# EAGLE design diagram (EAGLE 9.6.2)
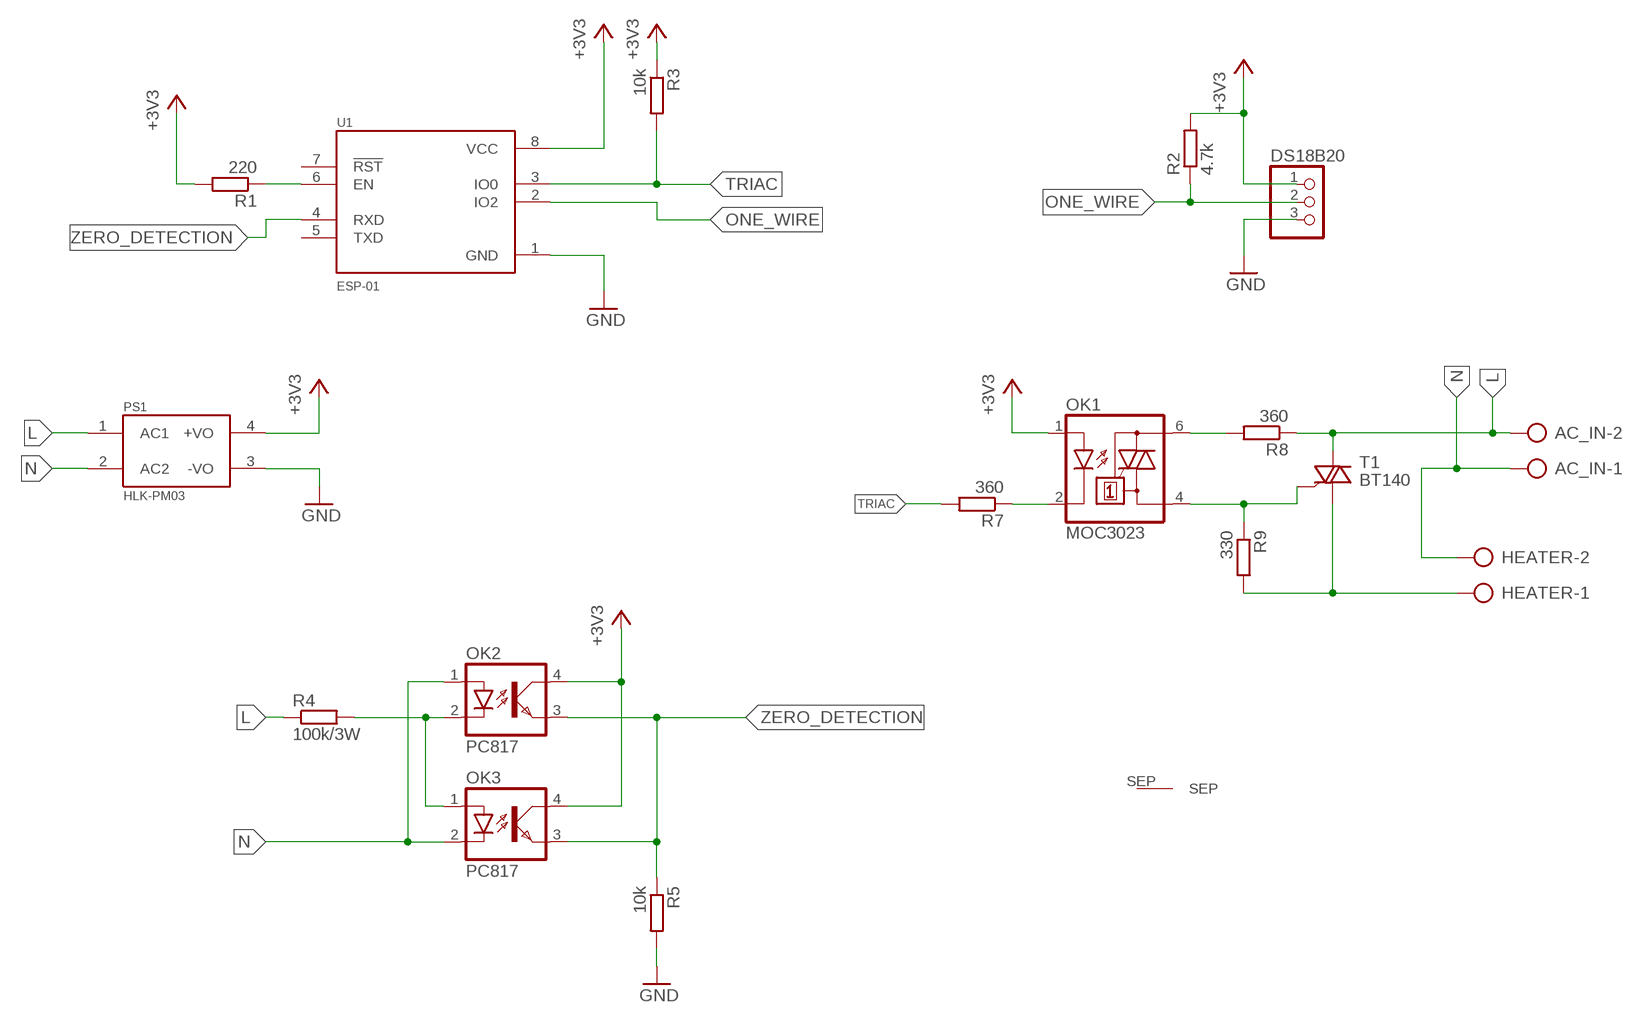
[diagram p0: schematic, sheet 1]

## Parts
AC_IN  AK300/2  [AK300/2]
DS18B20  PINHD-1X3  [1X03]
HEATER  AK300/2  [AK300/2]
OK1  MOC3023  MOC3041M  [DIL06]
OK2  PC817  [DIL04]
OK3  PC817  [DIL04]
PS1  HLK-PM03  [CONV_HLK-PM03]
R1  220  R-EU_R1206  [R1206]
R2  4.7k  R-EU_R1206  [R1206]
R3  10k  R-EU_0204/5  [0204/5]
R4  100k/3W  R-EU_0414/15  [0414/15]
R5  10k  R-EU_0204/7  [0204/7]
R7  360  R-EU_M1206  [M1206]
R8  360  R-EU_M1206  [M1206]
R9  330  R-EU_M1206  [M1206]
T1  BT140  BT138-V  [TO220BV]
U1  ESP-01  ESP8266-01/ESP-01  [XCVR_ESP8266-01/ESP-01]
U$1  TEST  [V7142]

## Nets
+3V3: DS18B20.1 OK1.1(A) OK2.4(COL) OK3.4(COL) PS1.4(+VO) R1.2 R2.2 R3.1 U1.8(VCC)
GND: DS18B20.3 PS1.3(-VO) R5.2 U1.1(GND)
L: AC_IN.2 PS1.1(AC1) R4.1 R8.1 T1.T2(A2)
N: AC_IN.1 HEATER.2 OK2.1(A) OK3.2(C) PS1.2(AC2)
N$1: R1.1 U1.6(EN)
N$4: OK2.2(C) OK3.1(A) R4.2
N$7: OK1.6(A2) R8.2
N$9: OK1.4(A1) R9.1 T1.G
N$11: HEATER.1 R9.2 T1.T1(A1)
N$39: OK1.2(C) R7.1
ONE_WIRE: DS18B20.2 R2.1 U1.2(IO2)
TRIAC: R3.2 R7.2 U1.3(IO0)
ZERO_DETECTION: OK2.3(EMIT) OK3.3(EMIT) R5.1 U1.4(RXD)
Unconnected: U1.5(TXD) U1.7(!RST) U$1.SEP

## Library data of the parts
AC_IN HEATER = con-ptr500:AK300/2: CONNECTOR; OC_FARNELL: unknown; OC_NEWARK: unknown
DS18B20 = pinhead:PINHD-1X3: PIN HEADER
OK1 = optocoupler:MOC30*: 6-Pin DIP Zero-Cross Optoisolators Triac Driver Output (250/400 Volt Peak) Source: Data sheet <http://www.fairchildsemi.com/ds/MO/MOC3031M.pdf> The old path of data sheet not more available 2013-05-06.; MF: FAIRCHILD SEMICONDUCTOR; MPN: MOC3041M; OC_FARNELL: 1086677; OC_NEWARK: 78K6090
OK2 OK3 = optocoupler:PC817: SHARP OPTO COUPLER; MPN: PC817X4J000F; OC_FARNELL: 9707727; OC_NEWARK: 97K7059
PS1 = HLK-PM03:HLK-PM03: Check availability <https://pricing.snapeda.com/parts/HLK-PM03/Hi-link/view-part?ref=eda>; AVAILABILITY: Not in stock; MF: Hi-link; MP: HLK-PM03; PACKAGE: Package; PRICE: None
R1-R5 R7-R9 = rcl:R-EU_: RESISTOR, European symbol; SPICEPREFIX: R
T1 = triac:BT138: TRIAC Source: http://www.semiconductors.philips.com BT138_SERIES_2.pdf
U1 = ESP8266-01_ESP-01:ESP8266-01/ESP-01: MakerFocus 4pcs ESP8266 ESP-01 Serial Wireless WiFi Transceiver Receiver Module 1MB SPI Flash DC3.0-3.6V Internet of Things WiFi Module Board Compatible with Ar duino Check availability <https://pricing.snapeda.com/parts/ESP8266-01/ESP-01/AI-Thinker/view-part?ref=eda>; AVAILABILITY: Not in stock; DESCRIPTION: MakerFocus 4pcs ESP8266 ESP-01 Serial Wireless WiFi Transceiver Receiver Module 1MB SPI Flash DC3.0-3.6V Internet of Things WiFi Module Board Compatible with Ar duino; MF: AI-Thinker; MP: ESP8266-01/ESP-01; PACKAGE: Non-Standard AI-Thinker; PRICE: None
U$1 = V7142_4:TEST: as

## Board
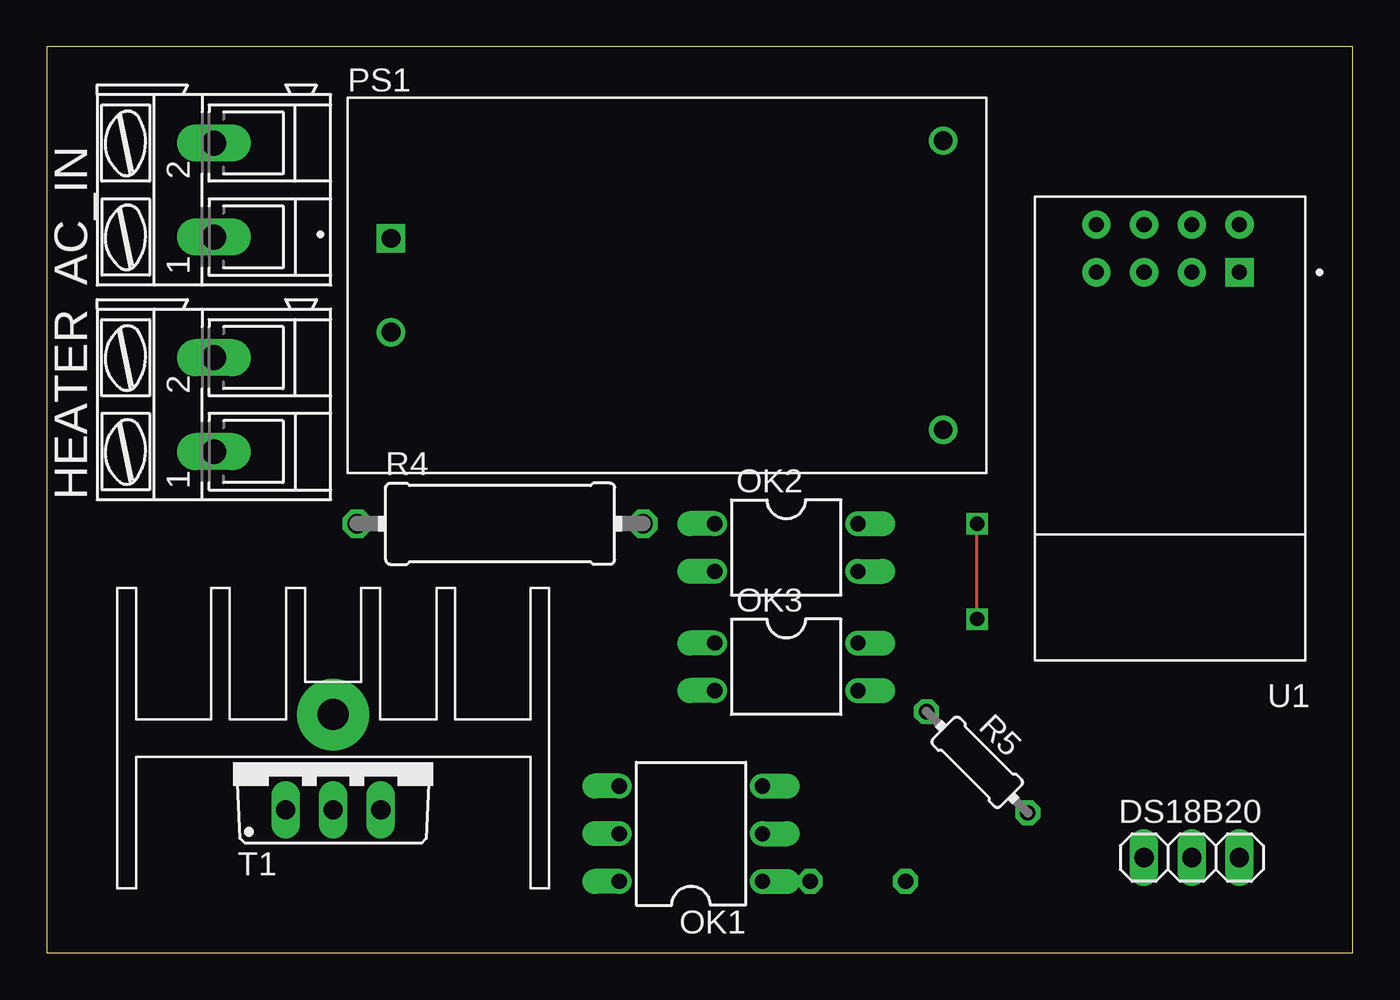
[diagram p1: board, top side]
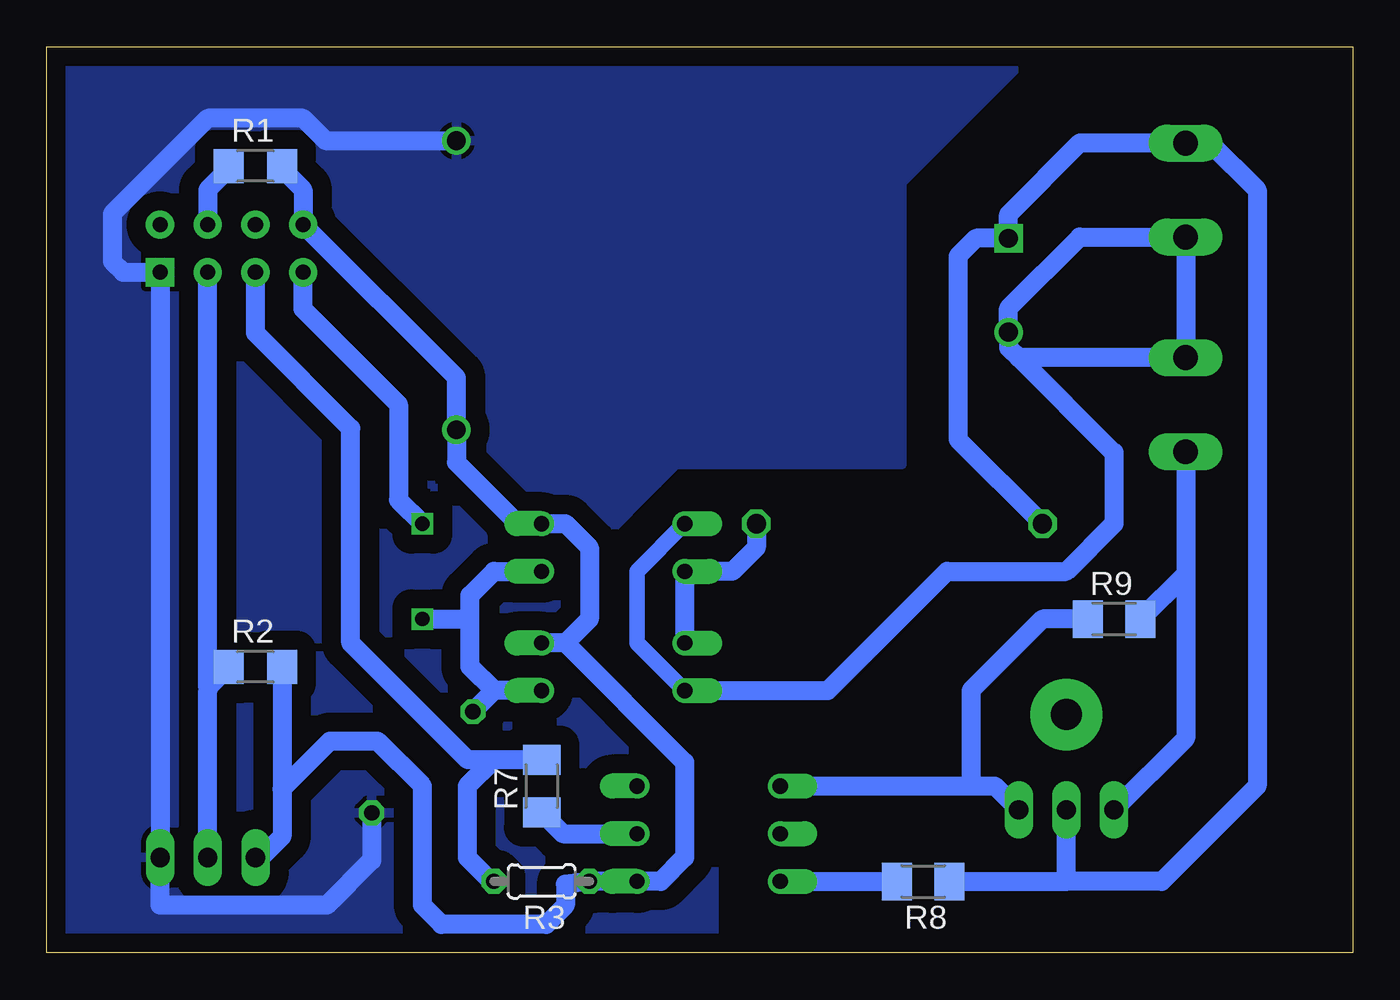
[diagram p2: board, bottom side, seen from below]

Size 69.52 x 48.25 mm. Coordinates in mm from the lower left corner, seen from the top.
Outline: 0,0 69.52,0 69.52,48.25 0,48.25 0,0
Copper layers (1*16): Top 0.035mm / dielectric 1.5mm / Bottom 0.035mm
Design rules "default": minimum track width 6mil, minimum drill 0.35mm, track to track 6mil, track to pad 6mil, pad to pad 6mil, via to via 6mil, smd to smd 6mil, copper to edge 40mil, drill to drill 6mil, minimum pad ring 10mil, minimum via ring 8mil, stop-mask expansion 4mil, vias tented up to drill 0mil, thermal gap 10mil

### Footprints (pad centres in the part's own frame; a part is rotated, then mirrored left to right if it is on the bottom)
AK300/2 = drill 1.321 long: 1 -2.515,0; 2 2.489,0
1X03 = drill 1.016 long: 1 -2.54,0; 2 0,0; 3 2.54,0
DIL06 = drill 0.813 offset: 1 -2.54,-3.81; 2 0,-3.81; 3 2.54,-3.81; 4 2.54,3.81; 5 0,3.81; 6 -2.54,3.81
DIL04 = drill 0.813 offset: 1 -1.27,-3.81; 2 1.27,-3.81; 3 1.27,3.81; 4 -1.27,3.81
CONV_HLK-PM03 = drill 1 square: 1 -14.7,2.5 | drill 1: 2 -14.7,-2.5; 3 14.7,7.7; 4 14.7,-7.7
R1206 = smd 1.6 x 1.803: 1 -1.422,0; 2 1.422,0
0204/5 = drill 0.813 octagon: 1 -2.54,0; 2 2.54,0
0414/15 = drill 1.016 octagon: 1 -7.62,0; 2 7.62,0
0204/7 = drill 0.813 octagon: 1 -3.81,0; 2 3.81,0
M1206 = smd 1.6 x 2: 1 -1.4,0; 2 1.4,0
TO220BV = drill 1.016 long: G 2.54,-2.54; T1 -2.54,-2.54; T2 0,-2.54
XCVR_ESP8266-01/ESP-01 = drill 0.8 pad 1.5 square: 1 -3.81,-8.31 | drill 0.8 pad 1.5: 2 -1.27,-8.31; 3 1.27,-8.31; 4 3.81,-8.31; 5 -3.81,-10.85; 6 -1.27,-10.85; 7 1.27,-10.85; 8 3.81,-10.85
V7142 = drill 1.65 pad 3.81: SEP 0,1.27

### Placement (x,y rotation side)
AC_IN  8.89,40.64 90 top
DS18B20  60.96,5.08 0 top
HEATER  8.89,29.21 90 top
OK1  34.29,6.35 90 top
OK2  39.37,21.59 270 top
OK3  39.37,15.24 270 top
PS1  33.02,35.56 0 top
R1  58.42,41.91 0 bottom
R2  58.42,15.24 0 bottom
R3  43.18,3.81 180 bottom
R4  24.13,22.86 0 top
R5  49.53,10.16 315 top
R7  43.18,8.89 90 bottom
R8  22.86,3.81 180 bottom
R9  12.7,17.78 0 bottom
T1  15.24,10.16 0 top
U1  59.69,27.94 180 top
U$1  15.24,11.43 0 top

### Tracks (layer width: path | path; a pad name or v marks a point on that pad's centre or on a via)
+3V3
  Bottom 1.016: 41.91,16.51 OK3.4 | 41.91,16.51 40.64,17.78 40.64,21.59 41.91,22.86 OK2.4 44.45,22.86 47.72,26.13 PS1.4 47.72,30.63 U1.8 55.88,40.64 57,41.76 R1.2 | 41.91,16.51 35.56,10.16 35.56,5.08 36.83,3.81 OK1.1 R3.1 41.91,3.66 41.91,2.54 42.93,1.52 48.51,1.52 49.53,2.54 49.53,8.89 51.92,11.28 54.46,11.28 57,8.74 | R2.2 57,8.74 | 57,8.74 57,6.2 58.12,5.08 DS18B20.1
GND
  Bottom 1.016: PS1.3 54.69,43.26 55.88,44.45 60.96,44.45 66.04,39.37 66.04,36.83 65.46,36.25 U1.1 DS18B20.3 63.5,2.54 54.61,2.54 52.22,4.93 R5.2
  pour Bottom (isolate 1.016): 69,48 69,0 34,0 34,10 40,16 40,21 40,22 37,25 36,26 24,26 24,41 17,48
L
  Bottom 1.016: 15.24,3.81 10.16,3.81 5.08,8.89 5.08,40.64 7.62,43.18 7.67,43.13 AC_IN.2 14.51,43.14 18.32,39.33 PS1.1 20.05,38.06 21,37.11 21,27.35 R4.1 | 15.24,3.81 T1.T2 | R8.1 15.24,3.81
N
  Bottom 0.813: OK3.2 38.1,16.51 38.1,20.32 OK2.1
  Bottom 1.016: 17.78,31.7 HEATER.2 AC_IN.1 14.53,38.12 18.32,34.33 PS1.2 18.32,32.24 17.78,31.7 | 17.78,31.7 12.75,26.67 12.7,26.67 12.7,22.86 15.24,20.32 21.59,20.32 27.94,13.97 OK3.2
N$1
  Bottom 1.016: R1.1 59.84,41.76 60.96,40.64 U1.6
N$4
  Bottom 1.016: R4.2 31.75,21.59 33.02,20.32 OK2.2 OK3.1
N$7
  Bottom 1.016: OK1.6 R8.2
N$9
  Bottom 1.016: T1.G 19.05,8.89 20.32,8.89 | OK1.4 20.32,8.89 | 20.32,8.89 20.32,13.97 16.51,17.78 R9.1
N$11
  Bottom 1.016: R9.2 8.89,20.19 | HEATER.1 8.89,20.19 | 8.89,20.19 8.89,11.43 T1.T1
N$39
  Bottom 1.016: R7.1 42.04,6.35 OK1.2
ONE_WIRE
  Bottom 1.016: DS18B20.2 60.96,13.97 60.96,14.12 | 60.96,14.12 U1.2 | R2.1 60.96,14.12
TRIAC
  Bottom 1.016: R3.2 45.87,3.81 47.14,5.08 47.14,8.89 45.74,10.29 | R7.2 45.74,10.29 | 45.74,10.29 47.12,10.29 53.34,16.51 53.34,27.94 58.42,33.02 U1.3
ZERO_DETECTION  (via drill 0.75)
  Top 0.152: v49.53,17.78 v49.53,22.86
  Bottom 1.016: OK3.3 45.72,13.97 | 45.72,13.97 | 45.72,13.97 46.99,15.24 46.99,17.78 | 46.99,17.78 46.99,19.05 45.72,20.32 OK2.3 | U1.4 55.88,34.29 50.8,29.21 50.8,24.13 v49.53,22.86 | 45.72,13.97 R5.1 | v49.53,17.78 46.99,17.78